# EAGLE design dirtpipe-UNO-shield-v1 (EAGLE 9.6.2)
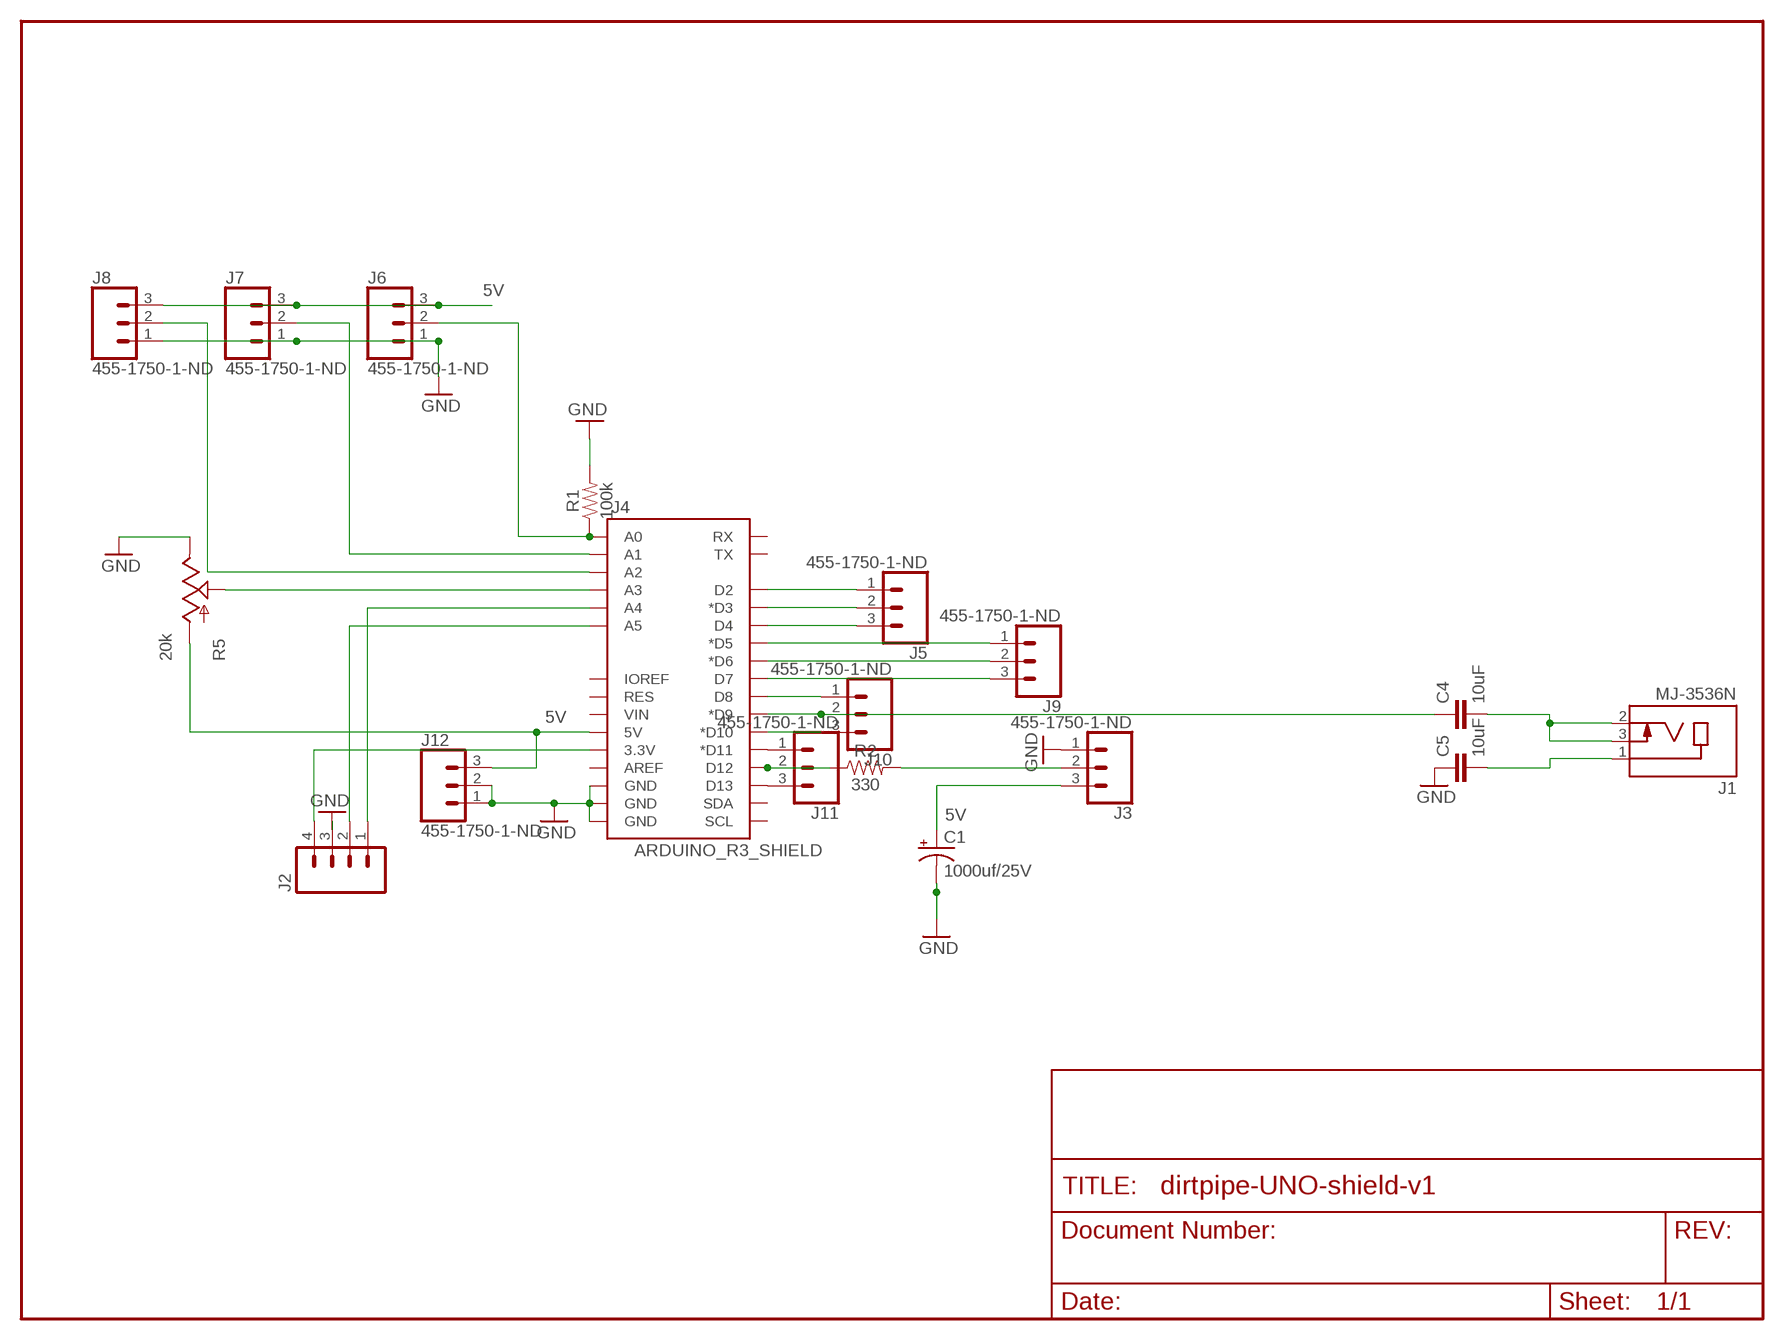
[diagram p0: schematic, sheet 1]

## Parts
C1  1000uf/25V  1000UF-25V(PTH)KIT  [CPOL-RADIAL-1000UF-25V-KIT]
C4  10uF  0.1UF-KIT-EZ-50V-20%  [CAP-PTH-SMALL-KIT]
C5  10uF  0.1UF-KIT-EZ-50V-20%  [CAP-PTH-SMALL-KIT]
J1  MJ-3536N  [CUI_MJ-3536N]
J2  M04PTH  [1X04]
J3  455-1750-1-ND  CONN_03  [1X03]
J4  ARDUINO_R3_SHIELD  [UNO_R3_SHIELD]
J5  455-1750-1-ND  CONN_03  [1X03]
J6  455-1750-1-ND  CONN_03  [1X03]
J7  455-1750-1-ND  CONN_03  [1X03]
J8  455-1750-1-ND  CONN_03  [1X03]
J9  455-1750-1-ND  CONN_03  [1X03]
J10  455-1750-1-ND  CONN_03  [1X03]
J11  455-1750-1-ND  CONN_03  [1X03]
J12  455-1750-1-ND  CONN_03  [1X03]
R1  100k  100KOHM-HORIZ-1/4W-1%  [AXIAL-0.3]
R2  330  330OHM-HORIZ-1/10W-5%  [AXIAL-0.3]
R5  20k  POTALPS-KIT  [ALPS_POT_KIT]

## Nets
5V: C1.+ J3.3 J4.5V J6.3 J7.3 J8.3 J12.3 R5.P$3(A)
CL: J2.2 J4.A5
DA: J2.1 J4.A4
GND: C1.- C5.1 J2.3 J3.1 J4.GND@0(GND) J4.GND@1(GND) J4.GND@2(GND) J6.1 J7.1 J8.1 J12.1 J12.2 R1.P$2 R5.P$1(E)
N$1: J4.D12 J11.2 R2.P$1
N$4: J4.A3 R5.P$2(S)
N$5: J4.D2 J5.1
N$6: J4.D3(*D3) J5.2
N$7: J4.D4 J5.3
N$8: J4.D5(*D5) J9.1
N$9: J4.D6(*D6) J9.2
N$10: J4.D7 J9.3
N$11: J4.D8 J10.1
N$12: J4.D10(*D10) J10.3
N$13: J4.D11(*D11) J11.1
N$14: C5.2 J1.1
N$15: C4.2 J1.2 J1.3
N$16: C4.1 J4.D9(*D9) J10.2
N$17: J3.2 R2.P$2
N$18: J4.A0 J6.2 R1.P$1
N$19: J4.A1 J7.2
N$22: J4.A2 J8.2
N$23: J4.D13 J11.3
VCC: J2.4 J4.3.3V
Unconnected: J4.AREF J4.IOREF J4.RES J4.RX J4.SCL J4.SDA J4.TX J4.VIN

## Library data of the parts
C1 = SparkFun-Capacitors:1000UF-25V(PTH): CAP-08070; PROD_ID: CAP-09538
C4 C5 = SparkFun-Capacitors:0.1UF: 0.1µF ceramic capacitors A capacitor is a passive two-terminal electrical component used to store electrical energy temporarily in an electric field.; PROD_ID: CAP-08370; VALUE: 0.1uF
J1 = MJ-3536N:MJ-3536N: 2 Conductors 3 Contacts 12V 3.5 mm Right Angle Through Hole Audio Jack Connector; MANUFACTURER: CUI INC; PART_REV: B; STANDARD: MANUFACTURER RECOMMENDATIONS
J2 = SparkFun-Connectors:M04: Header 4 Standard 4-pin 0.1" header. Use with straight break away headers (SKU : PRT-00116), right angle break away headers (PRT-00553), swiss pins (PRT-00743), machine pins (PRT-00117), and female headers (PRT-00115). Molex polarized connector foot print use with SKU : PRT-08231 with associated crimp pins and housings. 1MM SMD Version SKU: PRT-10208
J3 J5-J12 = SparkFun-Connectors:CONN_03: Multi connection point. Often used as Generic Header-pin footprint for 0.1 inch spaced/style header connections On any of the 0.1 inch spaced packages, you can populate with these: Break Away Headers - Straight <https://www.sparkfun.com/products/116> (PRT-00116) Break Away Male Headers - Right Angle <https://www.sparkfun.com/products/553> (PRT-00553) Female Headers <https://www.sparkfun.com/products/115> (PRT-00115) Break Away Headers - Machine Pin <https://www.sparkfun.com/products/117> (PRT-00117) Break Away Female Headers - Swiss Machine Pin <https://www.sparkfun.com/products/743> (PRT-00743) Stackable Header - 3 Pin (Female, 0.1") <https://www.sparkfun.com/products/13875> (PRT-13875) For SCREWTERMINALS and SPRING TERMINALS visit here: Screw Terimnals on SparkFun.com <https://www.sparkfun.com/search/results?term=Screw+Terminals> (5mm/3.5mm/2.54mm spacing) This device is also useful as a general connection point to wire up your design to another part of your project. Our various solder wires solder well into these plated through hole pads. Hook-Up Wire - Assortment (Stranded, 22 AWG) <https://www.sparkfun.com/products/11375> (PRT-11375) Hook-Up Wire - Assortment (Solid Core, 22 AWG) <https://www.sparkfun.com/products/11367> (PRT-11367) View the entire wire category on our website here <https://www.sparkfun.com/categories/141> Special notes: Molex polarized connector foot print use with SKU : PRT-08232 with associated crimp pins and housings.; PROD_ID: XXX-00000
J4 = SparkFun-Boards:ARDUINO_R3_SHIELD: Shield form compatible with the Arduino Uno R3.
R1 = SparkFun-Resistors:100KOHM: 100kΩ resistor A resistor is a passive two-terminal electrical component that implements electrical resistance as a circuit element. Resistors act to reduce current flow, and, at the same time, act to lower voltage levels within circuits. - Wikipedia; PROD_ID: RES-12184
R2 = SparkFun-Resistors:330OHM: 330Ω resistor A resistor is a passive two-terminal electrical component that implements electrical resistance as a circuit element. Resistors act to reduce current flow, and, at the same time, act to lower voltage levels within circuits. - Wikipedia; PROD_ID: RES-8371
R5 = SparkFun-Electromechanical:POT

## Net classes
0 default: width 0.203 mm
1 vcc: width 0.254 mm

## Board
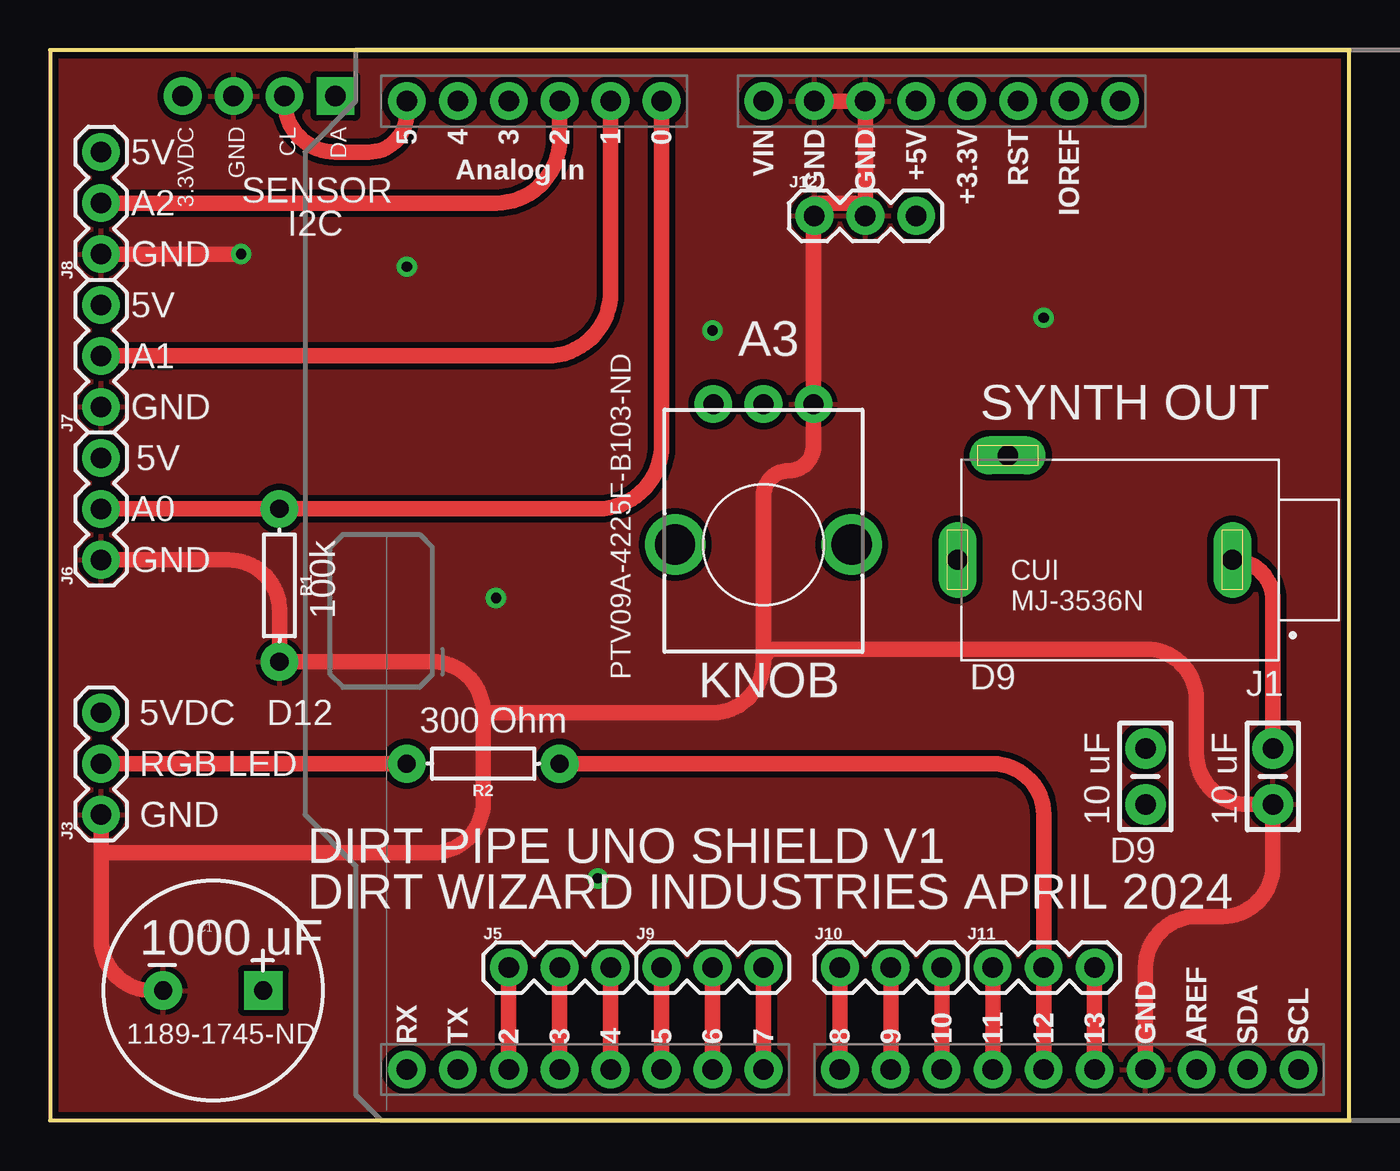
[diagram p1: board, top side]
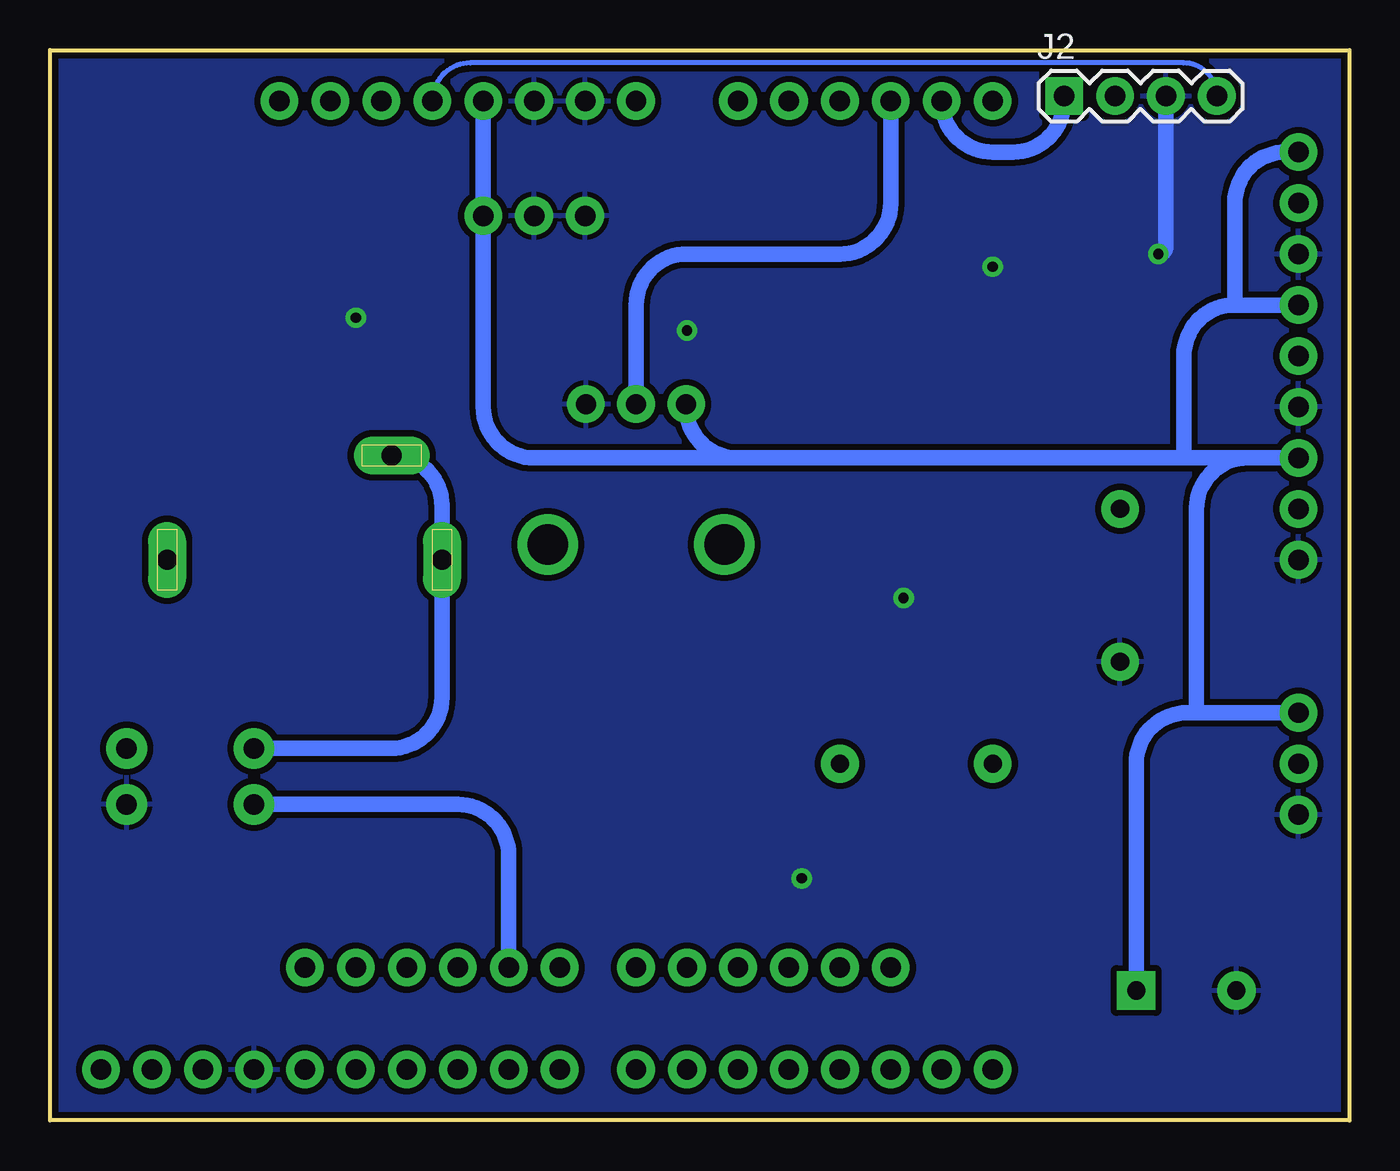
[diagram p2: board, bottom side, seen from below]

Size 64.77 x 53.34 mm. Coordinates in mm from the lower left corner, seen from the top.
Outline: 0,0 64.77,0 64.77,53.34 0,53.34 0,0
Copper layers (1*16): Top 0.035mm / dielectric 1.5mm / Bottom 0.035mm
Design rules "default": minimum track width 8mil, minimum drill 20mil, track to track 8mil, track to pad 8mil, pad to pad 8mil, via to via 8mil, smd to smd 8mil, copper to edge 10mil, drill to drill 8mil, minimum pad ring 12mil, minimum via ring 10mil, stop-mask expansion 4mil, vias tented up to drill 25mil, thermal gap 10mil

### Footprints (pad centres in the part's own frame; a part is rotated, then mirrored left to right if it is on the bottom)
CPOL-RADIAL-1000UF-25V-KIT = drill 0.9 pad 1.93 square: + 2.5,0 | drill 0.9 pad 1.93: - -2.5,0
CAP-PTH-SMALL-KIT = drill 1.016 pad 2.032: 1 -1.397,0; 2 1.397,0
CUI_MJ-3536N = drill 1 pad 1.9 long: 1 -5.6,0; 2 8.1,0; 3 5.6,-5.2
1X04 = drill 1.016 pad 1.88 square: 1 0,0 | drill 1.016 pad 1.88: 2 2.54,0; 3 5.08,0; 4 7.62,0
1X03 = drill 1.016 pad 1.88: 1 0,0; 2 2.54,0; 3 5.08,0
UNO_R3_SHIELD = drill 1.016 pad 1.88: 3.3V 50.8,26.67; 5V 50.8,29.21; A0 50.8,41.91; A1 50.8,44.45; A2 50.8,46.99; A3 50.8,49.53; A4 50.8,52.07; A5 50.8,54.61; AREF 2.54,15.24; D2 2.54,49.53; D3 2.54,46.99; D4 2.54,44.45; D5 2.54,41.91; D6 2.54,39.37; D7 2.54,36.83; D8 2.54,33.02; D9 2.54,30.48; D10 2.54,27.94; D11 2.54,25.4; D12 2.54,22.86; D13 2.54,20.32; GND@0 50.8,31.75; GND@1 50.8,34.29; GND@2 2.54,17.78; IOREF 50.8,21.59; NC 50.8,19.05; RES 50.8,24.13; RX 2.54,54.61; SCL 2.54,10.16; SDA 2.54,12.7; TX 2.54,52.07; VIN 50.8,36.83
AXIAL-0.3 = drill 0.9 pad 1.88: P$1 -3.81,0; P$2 3.81,0
ALPS_POT_KIT = drill 1 pad 1.88: P$1 7,-2.5; P$2 7,0; P$3 7,2.5 | drill 2: P$4 0,-4.4; P$5 0,4.4

### Placement (x,y rotation side)
C1  8.13,6.48 0 top
C4  54.61,17.14 90 top
C5  60.96,17.14 90 top
J1  53.34,27.94 180 top
J2  14.22,51.05 0 bottom
J3  2.54,15.24 90 top
J4  72.39,0 90 top
J5  22.86,7.62 0 top
J6  2.54,27.94 90 top
J7  2.54,35.56 90 top
J8  2.54,43.18 90 top
J9  30.48,7.62 0 top
J10  39.37,7.62 0 top
J11  46.99,7.62 0 top
J12  38.1,45.09 0 top
R1  11.43,26.67 270 top
R2  21.59,17.78 180 top
R5  35.56,28.7 90 top

### Tracks (layer width: path | path; a pad name or v marks a point on that pad's centre or on a via)
5V
  Bottom 0.762: J3.3 7.62,20.32 | 7.62,20.32 8.09,20.32 arc-90 10.63,17.78 C1.+ | 5.08,33.02 8.26,33.02 | 8.26,33.02 30.52,33.02 | 30.52,33.02 arc90 33.06,35.56 R5.P$3 | 30.52,33.02 40.64,33.02 arc90 43.18,35.56 J12.3 J4.5V | J7.3 5.71,40.64 | 5.71,40.64 arc-90 8.26,38.1 8.26,33.02 | 7.62,20.32 7.62,30.48 arc90 5.08,33.02 | 5.08,33.02 J6.3 | J8.3 3.17,48.26 arc-90 5.71,45.72 5.71,40.64
CL
  Top 0.762: J2.2 11.68,50.8 arc90 14.22,48.26 15.88,48.26 arc90 17.78,50.16 J4.A5
DA
  Bottom 0.762: J2.1 14.22,50.8 arc90 16.76,48.26 17.78,48.26 arc90 J4.A4
GND  (via drill 0.51)
  Top 0.762: J3.1 2.54,13.34 | 2.54,13.34 2.54,9.02 arc90 5.08,6.48 C1.- | J6.1 8.89,27.94 arc-90 11.43,25.4 R1.P$2 19.05,22.86 arc-90 21.59,20.32 | 21.59,20.32 21.59,15.88 arc-90 19.05,13.34 2.54,13.34 | 21.59,20.32 33.02,20.32 arc90 35.56,22.86 | 35.56,22.86 35.56,31.11 arc-90 36.83,32.38 arc90 38.06,33.62 R5.P$1 38.06,45.68 arc-90 38.1,45.72 40.01,45.72 arc-90 J12.2 J4.GND@0 J4.GND@1 | J4.GND@2 54.61,7.62 arc-90 57.15,10.16 58.42,10.16 arc90 60.96,12.7 C5.1 59.69,15.75 arc-90 57.15,18.29 57.15,20.95 arc90 54.61,23.5 36.2,23.5 arc90 35.56,22.86 | J8.1 v9.53,43.18
  Bottom 0.762: v9.53,43.18 arc-90 9.14,43.56 J2.3
  other vias: 17.78,42.55 22.22,26.04 27.3,12.06 33.02,39.37 49.53,40.01
  pour Top (isolate 0.305): -0.64,-1.27 -0.64,56.52 66.04,56.52 66.04,-1.27
  pour Bottom (isolate 0.305): -3.05,-2.54 -3.05,56.52 66.67,56.52 66.67,-2.54
N$1
  Top 0.762: R2.P$1 46.99,17.78 arc-90 49.53,15.24 J11.2 J4.D12
N$4
  Bottom 0.762: J4.A3 22.86,45.72 arc90 25.4,43.18 33.02,43.18 arc-90 35.56,40.64 R5.P$2
N$5
  Top 0.762: J4.D2 J5.1
N$6
  Top 0.762: J4.D3 J5.2
N$7
  Top 0.762: J4.D4 J5.3
N$8
  Top 0.762: J4.D5 J9.1
N$9
  Top 0.762: J4.D6 J9.2
N$10
  Top 0.762: J9.3 J4.D7
N$11
  Top 0.762: J4.D8 J10.1
N$12
  Top 0.762: J4.D10 J10.3
N$13
  Top 0.762: J4.D11 J11.1
N$14
  Top 0.762: J1.1 arc-90 60.96,25.92 C5.2
N$15
  Bottom 0.762: C4.2 47.78,18.54 arc-90 45.24,21.08 J1.2 45.24,30.64 arc-90 J1.3
N$16
  Top 0.762: J4.D9 J10.2
  Bottom 0.762: J10.2 41.91,13.21 arc-90 44.45,15.75 C4.1
N$17
  Top 0.762: J3.2 R2.P$2
N$18
  Top 0.762: J6.2 R1.P$1 27.3,30.48 arc90 30.48,33.66 J4.A0
N$19
  Top 0.762: J7.2 24.77,38.1 arc90 27.94,41.27 J4.A1
N$22
  Top 0.762: J8.2 22.22,45.72 arc90 25.4,48.9 J4.A2
N$23
  Top 0.762: J4.D13 J11.3
VCC
  Bottom 0.254: J2.4 arc-90 8.26,52.7 43.82,52.7 arc-90 J4.3.3V

### Text on the board
tPlace: 3.3VDC | GND | CL | DA | 5V | A2 | SENSOR | I2C | GND | 5V | A1 | A3 | GND | SYNTH OUT | 5V | A0 | GND | 100k | CUI / MJ-3536N | KNOB | PTV09A-4225F-B103-ND | D9 | 5VDC | D12 | 300 Ohm | RGB LED | GND | 10 uF | 10 uF | D9 | DIRT PIPE UNO SHIELD V1 | DIRT WIZARD INDUSTRIES APRIL 2024 | 1000 uF | 1189-1745-ND
tValues: Tent Vias! | Arduino Wee v1.3